# Altium project CoolerUI-BotPCB.PrjPcb
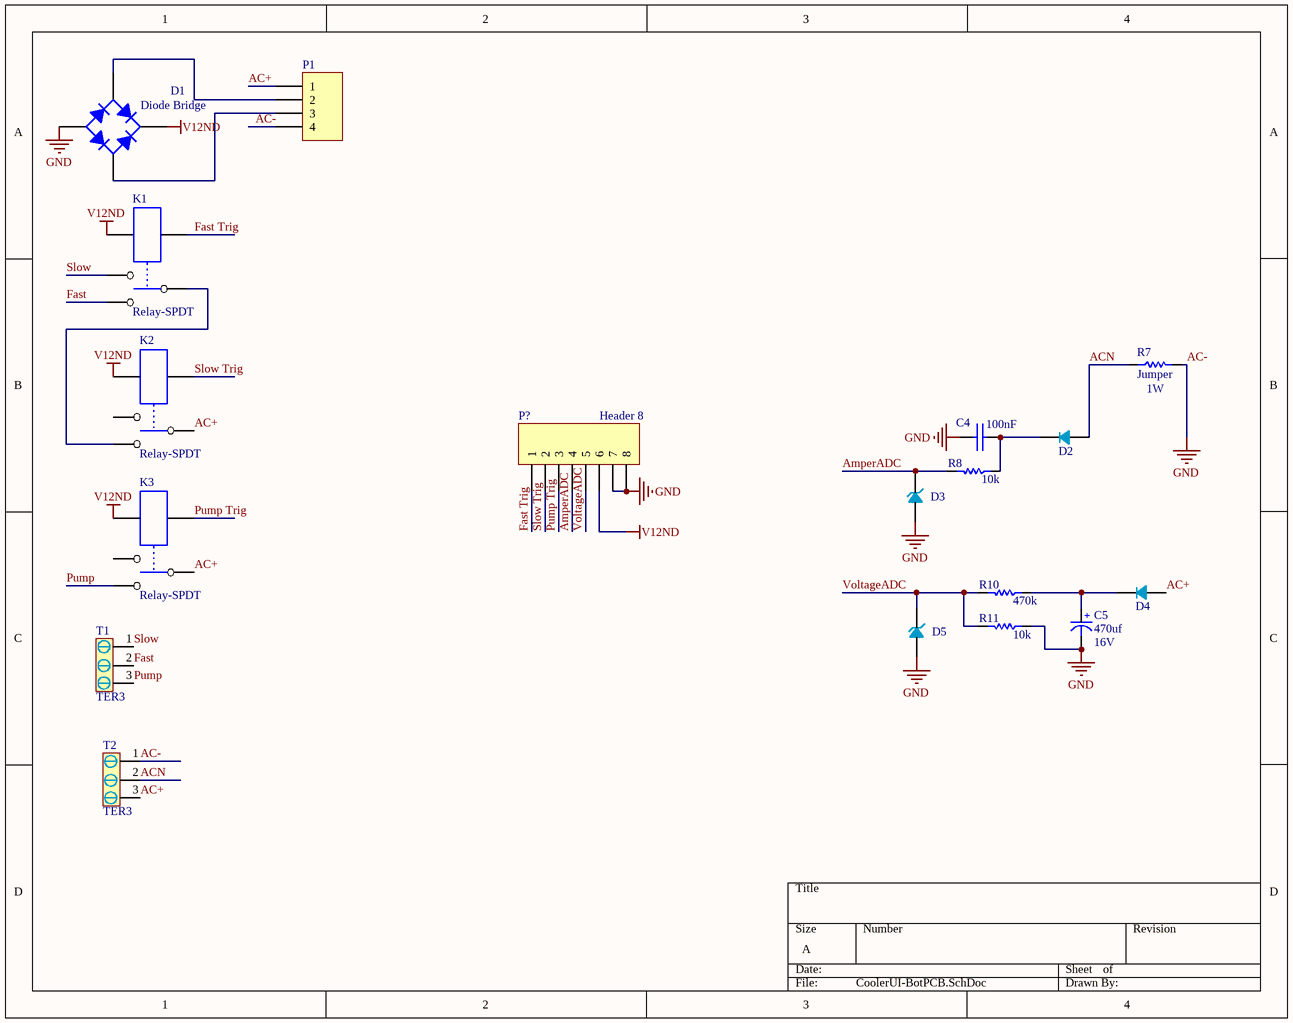
[diagram p0: CoolerUI-BotPCB.SchDoc]
1 sheet, 18 parts. Net scope: global (net labels, ports and power ports of the same name join across sheets).
Board file: CoolerUI-BotPCB.PcbDoc

## Sheet CoolerUI-BotPCB.SchDoc
size A

### Parts
C4  100nF  [SMD_CAP_0805]
C5  Voltage: 16V  [cap 03]  (hidden comment: 470uf)
D1  Diode Bridge  [Bridge]
D2  1n4001-7 SMD  [DO-214AC ( SMD Diode )]  (value not drawn)
D3  Diode Zener SMD  [DIOMELF3615N]  (value not drawn)
D4  1n4001-7 SMD  [DO-214AC ( SMD Diode )]  (value not drawn)
D5  Diode Zener SMD  [DIOMELF3615N]  (value not drawn)
K1  Relay-SPDT  [My_rel]
K2  Relay-SPDT  [My_rel]
K3  Relay-SPDT  [My_rel]
P1  Header 4  [My_1X04]  (value not drawn)
P?  Header 8  [HDR1X8]
R7  Power: 1W  [Res-(1/1)]  (hidden comment: Jumper)
R8  10k  [RES 0805 (2012X06L)]
R10  470k  [RES 0805 (2012X06L)]
R11  10k  [RES 0805 (2012X06L)]
T1  TER3  [TER3]
T2  TER3  [TER3]

### Nets
AC-: C4.1(+) C5.2(-) D1.3(A) D3.2 D5.2 P1.4 P?.7 P?.8 R7.2 R11.1 T2.1  [also labelled GND]
V12ND: D1.1(K) K1.5 K2.5 K3.5 P?.6
AC+: D4.0 K2.1 K3.1 P1.1 T2.3
ACN: D2.0 R7.1 T2.2
AmperADC: D3.1 P?.4 R8.2
Fast: K1.2 T1.2
Fast Trig: K1.4 P?.1
Pump: K3.2 T1.3
Pump Trig: K3.4 P?.3
Slow: K1.3 T1.1
Slow Trig: K2.4 P?.2
VoltageADC: D5.1 P?.5 R10.2 R11.2
NetC4_2: C4.2(-) D2.1 R8.1
NetC5_1: C5.1(+) D4.1 R10.1
NetD1_2: D1.2(C) P1.3
NetD1_4: D1.4(C) P1.2
NetK1_1: K1.1 K2.2

Not connected (* = marked no-connect by the designer): K2 3; K3 3

### Library data of the parts
C4 = Cap-Bipolar: Bipolar Capacitor; Voltage: 100V; Designer: Saeid Jorablo; Organazation: ControTec; Adding Date: 1387/12/20; Value: 100nF
C5 = Cap-Polar: Polar Capacitor; Designer: Saeid Jorablo; Organazation: ControTec; Adding Date: 1387/12/20; Value: 470uf
D1 = Diode Bridge: Full Wave Diode Bridge; Company: E.P.I.L; Design Date: 2011/11/02
D2 D4 = 1n4001-7 SMD: Designer :: Hamed Jafarzadeh
D3 D5 = Diode Zener SMD: Designer: Hamed Jafarzadeh
K1-K3 = Relay-SPDT: standard single contact relay
P1 = Header 4: Header, 4-Pin; LatestRevisionDate: 17-Jul-2002; LatestRevisionNote: Re-released for DXP Platform.; Publisher: Altium Limited
P? = Header 8: Header, 8-Pin; LatestRevisionDate: 17-Jul-2002; LatestRevisionNote: Re-released for DXP Platform.; Publisher: Altium Limited
R7 = Resistor: Tolerance: 5%; Value: Jumper
R8 R10 R11 = Resistor: Tolerance: 5%; Power: 1/8 W
  R8 R11: Value: 10k
  R10: Value: 470k